# EAGLE design main (EAGLE 7.5.0)
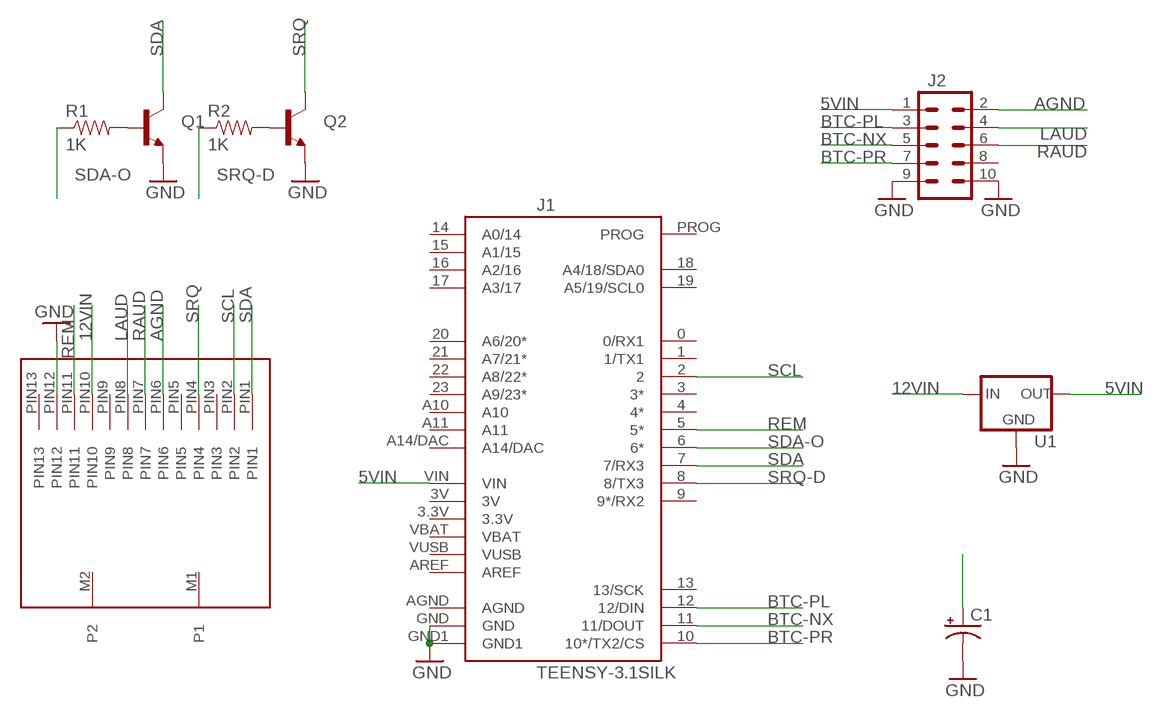
[diagram p0: schematic, sheet 1]

## Parts
C1  10UF-25V-20%(PTH)  [CPOL-RADIAL-10UF-25V]
J1  TEENSY-3.1SILK  [TEENSY-3.1]
J2  M05X2NO_SILK  [2X5_NOSILK]
Q1  TRANSISTOR_NPN2N3904  [TO-92]
Q2  TRANSISTOR_NPN2N3904  [TO-92]
R1  1K  1KOHM-1/4W-1%(PTH)  [AXIAL-0.3]
R2  1K  1KOHM-1/4W-1%(PTH)  [AXIAL-0.3]
U1  V_REG_78XX-TO-220  [TO-220-ALT]
U$1  13-DIN13PINDIN  [DIN-13]

## Nets
5VIN: C1.1(+) J1.VIN J2.1 U1.OUT
12VIN: U1.IN U$1.PIN10
AGND: J2.2 U$1.PIN6
BTC-NX: J1.11(11/DOUT) J2.5
BTC-PL: J1.12(12/DIN) J2.3
BTC-PR: J1.10(10*/TX2/CS) J2.7
GND: C1.2(-) J1.GND J1.GND1 J2.9 J2.10 Q1.1(E) Q2.1(E) U1.GND U$1.PIN12
LAUD: J2.4 U$1.PIN8
N$1: Q1.2(B) R1.P$2
N$2: Q2.2(B) R2.P$2
RAUD: J2.6 U$1.PIN7
REM: J1.5(5*) U$1.PIN11
SCL: J1.2 U$1.PIN2
SDA: J1.7(7/RX3) Q1.3(C) U$1.PIN1
SDA-O: J1.6(6*) R1.P$1
SRQ: Q2.3(C) U$1.PIN4
SRQ-D: J1.8(8/TX3) R2.P$1
Unconnected: J1.0(0/RX1) J1.1(1/TX1) J1.3(3*) J1.3.3V J1.3V J1.4(4*) J1.9(9*/RX2) J1.13(13/SCK) J1.14(A0/14) J1.15(A1/15) J1.16(A2/16) J1.17(A3/17) J1.18(A4/18/SDA0) J1.19(A5/19/SCL0) J1.20(A6/20*) J1.21(A7/21*) J1.22(A8/22*) J1.23(A9/23*) J1.A10 J1.A11 J1.A14/DAC J1.AGND J1.AREF J1.PROG J1.VBAT J1.VUSB J2.8 U$1.M1(P1) U$1.M2(P2) U$1.PIN3 U$1.PIN5 U$1.PIN9 U$1.PIN13

## Library data of the parts
C1 = SparkFun-Capacitors:10UF-25V-20%(PTH): CAP-08440; PROD_ID: CAP-08440
J1 = SparkFun-Boards:TEENSY-3.1; SF_ID: DEV-12646
J2 = SparkFun-Connectors:M05X2: Header 5x2 Standard 10-pin dual row 0.1" header. Commonly used with AVR-ISP. Use with Spark Fun Electronics SKU: PRT-00778
Q1 Q2 = SparkFun-DiscreteSemi:TRANSISTOR_NPN: Generic NPN BJT MMBT2222A - TRANS-08049 (SOT-23, 1A 40V) MPSA42 - TRANS-09116 (SOT-23, 500mA 300V) MMBT5088LT1G - TRANS-11160 (SOT-23, 50 mA 30V) BC547 - COM-08928 <http://www.sparkfun.com/products/8928> (TO-92 45V 100mA) (1.Collector 2.Base 3.Emitter) 2N3904 - COM-00521 <http://www.sparkfun.com/products/521> (TO-92 40V 200mA) (1.Emitter 2.Base 3.Collector) P2N2222A - COM-12852 <http://www.sparkfun.com/products/12852> (TO-92 40V 600mA) (1.Collector 2.Base 3.Emitter); PROD_ID: TRANS-08447
R1 R2 = SparkFun-Resistors:1KOHM-1/4W-1%(PTH): RES-12182; PROD_ID: RES-12182
U1 = SparkFun-PowerIC:V_REG_78XX: Voltage Regulator Standard 78xx regulator. IGO (Input Ground Output). Spark Fun Electronics SKU : COM-00107; PROD_ID: VREG-08450; SF_ID: COM-00107
U$1 = 13PINDIN:13-DIN: Right-angled mountable 13-pin DIN socket for multichannel (MIDI) guitar circuits.

## Board
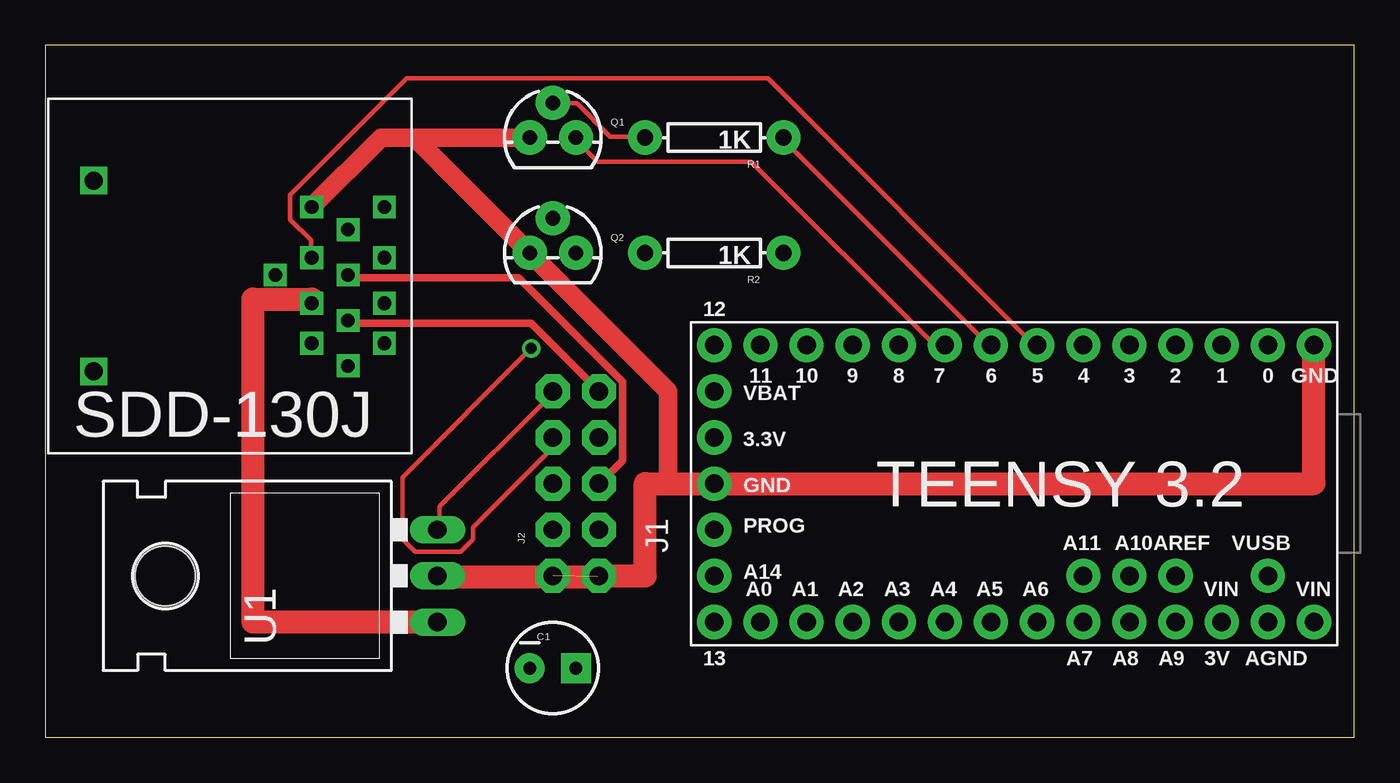
[diagram p1: board, top side]
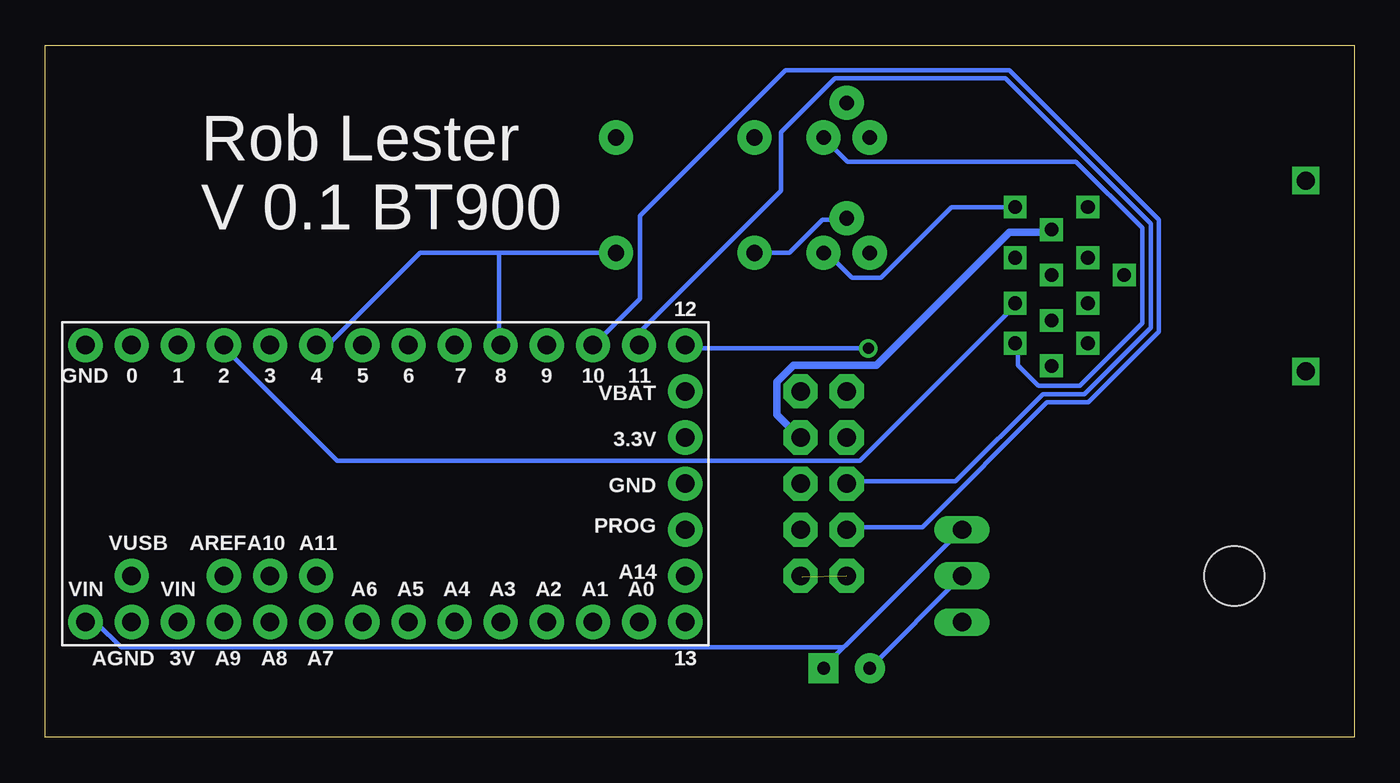
[diagram p2: board, bottom side, seen from below]

Size 72.06 x 38.09 mm. Coordinates in mm from the lower left corner, seen from the top.
Outline: 0,0 72.06,0 72.06,38.09 0,38.09 0,0
Copper layers (1*16): Top 0.035mm / dielectric 1.5mm / Bottom 0.035mm
Design rules "default": minimum track width 10mil, minimum drill 24mil, track to track 8mil, track to pad 8mil, pad to pad 8mil, via to via 8mil, smd to smd 8mil, copper to edge 40mil, drill to drill 8mil, minimum pad ring 10mil, minimum via ring 8mil, stop-mask expansion 4mil, vias tented up to drill 0mil, thermal gap 10mil

### Footprints (pad centres in the part's own frame; a part is rotated, then mirrored left to right if it is on the bottom)
CPOL-RADIAL-10UF-25V = drill 0.7 pad 1.651 square: 1 1.27,0 | drill 0.7 pad 1.651: 2 -1.27,0
TEENSY-3.1 = drill 1.016 pad 1.88: 0 16.51,3.81; 1 16.51,6.35; 2 16.51,8.89; 3 16.51,11.43; 3.3V 11.43,34.29; 3V 1.27,6.35; 4 16.51,13.97; 5 16.51,16.51; 6 16.51,19.05; 7 16.51,21.59; 8 16.51,24.13; 9 16.51,26.67; 10 16.51,29.21; 11 16.51,31.75; 12 16.51,34.29; 13 1.27,34.29; 14 1.27,31.75; 15 1.27,29.21; 16 1.27,26.67; 17 1.27,24.13; 18 1.27,21.59; 19 1.27,19.05; 20 1.27,16.51; 21 1.27,13.97; 22 1.27,11.43; 23 1.27,8.89; A10 3.81,11.43; A11 3.81,13.97; A14/DAC 3.81,34.29; AGND 1.27,3.81; AREF 3.81,8.89; GND 8.89,34.29; GND1 16.51,1.27; PROG 6.35,34.29; VBAT 13.97,34.29; VIN 1.27,1.27; VUSB 3.81,3.81
2X5_NOSILK = drill 1.016 pad 1.88 octagon: 1 -1.27,5.08; 2 1.27,5.08; 3 -1.27,2.54; 4 1.27,2.54; 5 -1.27,0; 6 1.27,0; 7 -1.27,-2.54; 8 1.27,-2.54; 9 -1.27,-5.08; 10 1.27,-5.08
TO-92 = drill 0.813 pad 1.88: 1 -1.27,0; 2 0,1.905; 3 1.27,0
AXIAL-0.3 = drill 0.9 pad 1.88: P$1 -3.81,0; P$2 3.81,0
TO-220-ALT = drill 1.016 long: GND 0,-3.81; IN -2.54,-3.81; OUT 2.54,-3.81 | hole 3.302: 0,11.176
DIN-13 = drill 1 square: M1 -5.25,7.5; M2 5.25,7.5 | drill 0.75 square: PIN1 -3.7,-8.5; PIN2 -1.5,-8.5; PIN3 1,-8.5; PIN4 3.8,-8.5; PIN5 -4.95,-6.5; PIN6 -2.45,-6.5; PIN7 0.05,-6.5; PIN8 2.55,-6.5; PIN9 -3.7,-4.5; PIN10 -1.5,-4.5; PIN11 1,-4.5; PIN12 3.8,-4.5; PIN13 0.05,-2.5

### Placement (x,y rotation side)
C1  27.94,3.81 0 top
J1  71.12,5.08 90 top
J2  29.21,13.97 0 top
Q1  27.94,33.02 0 top
Q2  27.94,26.67 0 top
R1  36.83,33.02 180 top
R2  36.83,26.67 180 top
U1  17.78,8.89 90 top
U$1  10.16,25.4 90 top

### Tracks (layer width: path | path; a pad name or v marks a point on that pad's centre or on a via)
5VIN
  Top 0.254: U1.OUT 21.72,11.58 21.72,12.73 27.89,18.9 J2.1
  Bottom 0.254: 28.12,4.95 67.89,4.95 69.27,6.33 69.72,6.33 J1.VIN | 28.12,4.95 27.96,5.11 21.72,11.35 U1.OUT | C1.1 29.21,3.86 28.12,4.95
12VIN
  Top 0.254: 14.66,24.13 U$1.PIN10
  Top 1.27: U1.IN 11.43,6.35 11.43,24.13 14.66,24.13
AGND
  Top 0.254: 16.69,22.78 U$1.PIN6
  Top 0.406: 16.69,22.78 26.75,22.78 J2.2
BTC-NX
  Bottom 0.254: J2.5 27.89,14.1 21.95,14.1 17.14,18.9 14.86,18.9 11.2,22.56 11.2,28.27 19.2,36.27 28.57,36.27 31.55,33.3 31.55,30.1 39.32,22.33 39.32,21.64 J1.11
BTC-PL  (via drill 0.61)
  Top 0.254: v26.75,21.41 19.66,14.33 19.66,10.9 20.34,10.21 22.86,10.21 23.55,10.9 23.55,11.58 27.89,15.93 27.89,16.38 J2.3
  Bottom 0.254: v26.75,21.41 36.8,21.41 J1.12
BTC-PR
  Bottom 0.254: J2.7 27.89,11.58 23.77,11.58 16.92,18.44 14.63,18.44 10.74,22.33 10.74,28.5 18.97,36.73 31.32,36.73 39.32,28.73 39.32,24.16 41.83,21.64 J1.10
GND  (1 unrouted)
  Top 0.254: 21.72,8.84 U1.GND | 30.4,8.84 J2.10 30.48,8.84
  Top 1.016: U$1.PIN12 18.48,33.02 20.32,33.02 | 20.32,33.02 Q1.1 | 20.32,33.02 Q2.1 34.29,19.05 34.29,13.97
  Top 1.27: 21.72,8.84 30.48,8.84 | J2.10 33.02,8.89 33.02,13.97 34.29,13.97 J1.GND 69.85,13.97 J1.GND1
  Bottom 0.254: U1.GND C1.2
LAUD
  Bottom 0.254: 16.69,27.81 U$1.PIN8 | 30.63,16.61 J2.4
  Bottom 0.406: 16.69,27.81 18.97,27.81 26.29,20.5 30.86,20.5 31.77,19.58 31.77,17.76 30.63,16.61
N$1
  Top 0.254: R1.P$2 32.92,33.07 31.09,33.07 29.26,34.9 28.12,34.9 Q1.2
N$2
  Bottom 0.254: R2.P$2 31.09,26.67 29.26,28.5 28.12,28.5 Q2.2
RAUD
  Top 0.254: 16.69,25.3 U$1.PIN7 | 30.63,14.1 J2.6
  Top 0.406: 16.69,25.3 26.06,25.3 31.77,19.58 31.77,15.24 30.63,14.1
REM
  Top 0.254: U$1.PIN11 14.63,26.44 14.63,27.36 13.49,28.5 13.49,29.87 19.89,36.27 39.78,36.27 54.41,21.64 J1.5
SCL
  Bottom 0.254: U$1.PIN2 18.75,23.7 27.2,15.24 56.01,15.24 62.18,21.41 J1.2
SDA
  Top 0.254: J1.7 49.38,21.64 48.92,21.64 38.86,31.7 30.4,31.7 29.26,32.84 Q1.3
  Bottom 0.254: Q1.3 27.89,31.7 15.32,31.7 11.66,28.04 11.66,22.78 15.09,19.36 17.37,19.36 18.52,20.5 18.52,21.64 U$1.PIN1
SDA-O
  Top 0.254: J1.6 51.89,21.64 40.69,32.84 R1.P$1
SRQ
  Bottom 0.254: U$1.PIN4 18.75,29.19 22.17,29.19 26.06,25.3 27.66,25.3 29.03,26.67 Q2.3
SRQ-D
  Bottom 0.254: 57.15,21.64 56.46,21.64 51.44,26.67 47.09,26.67 | R2.P$1 47.09,26.67 | 47.09,26.67 47.09,21.64 J1.8

### Text on the board
_tsilk: TEENSY 3.2
_bsilk: Rob Lester / V 0.1 BT900